# EasyEDA Pro project 电路图.eprj

# Schematic Schematic1
Board Name: Board1; Create Date: 2025-07-12; Page Name: P1; Project Name: 电路图; Schematic Name: Schematic1; Update Date: 2025-11-16; Company: 嘉立创EDA; Drawed: 陈师傅; Page Size: A4; Version: V1.0
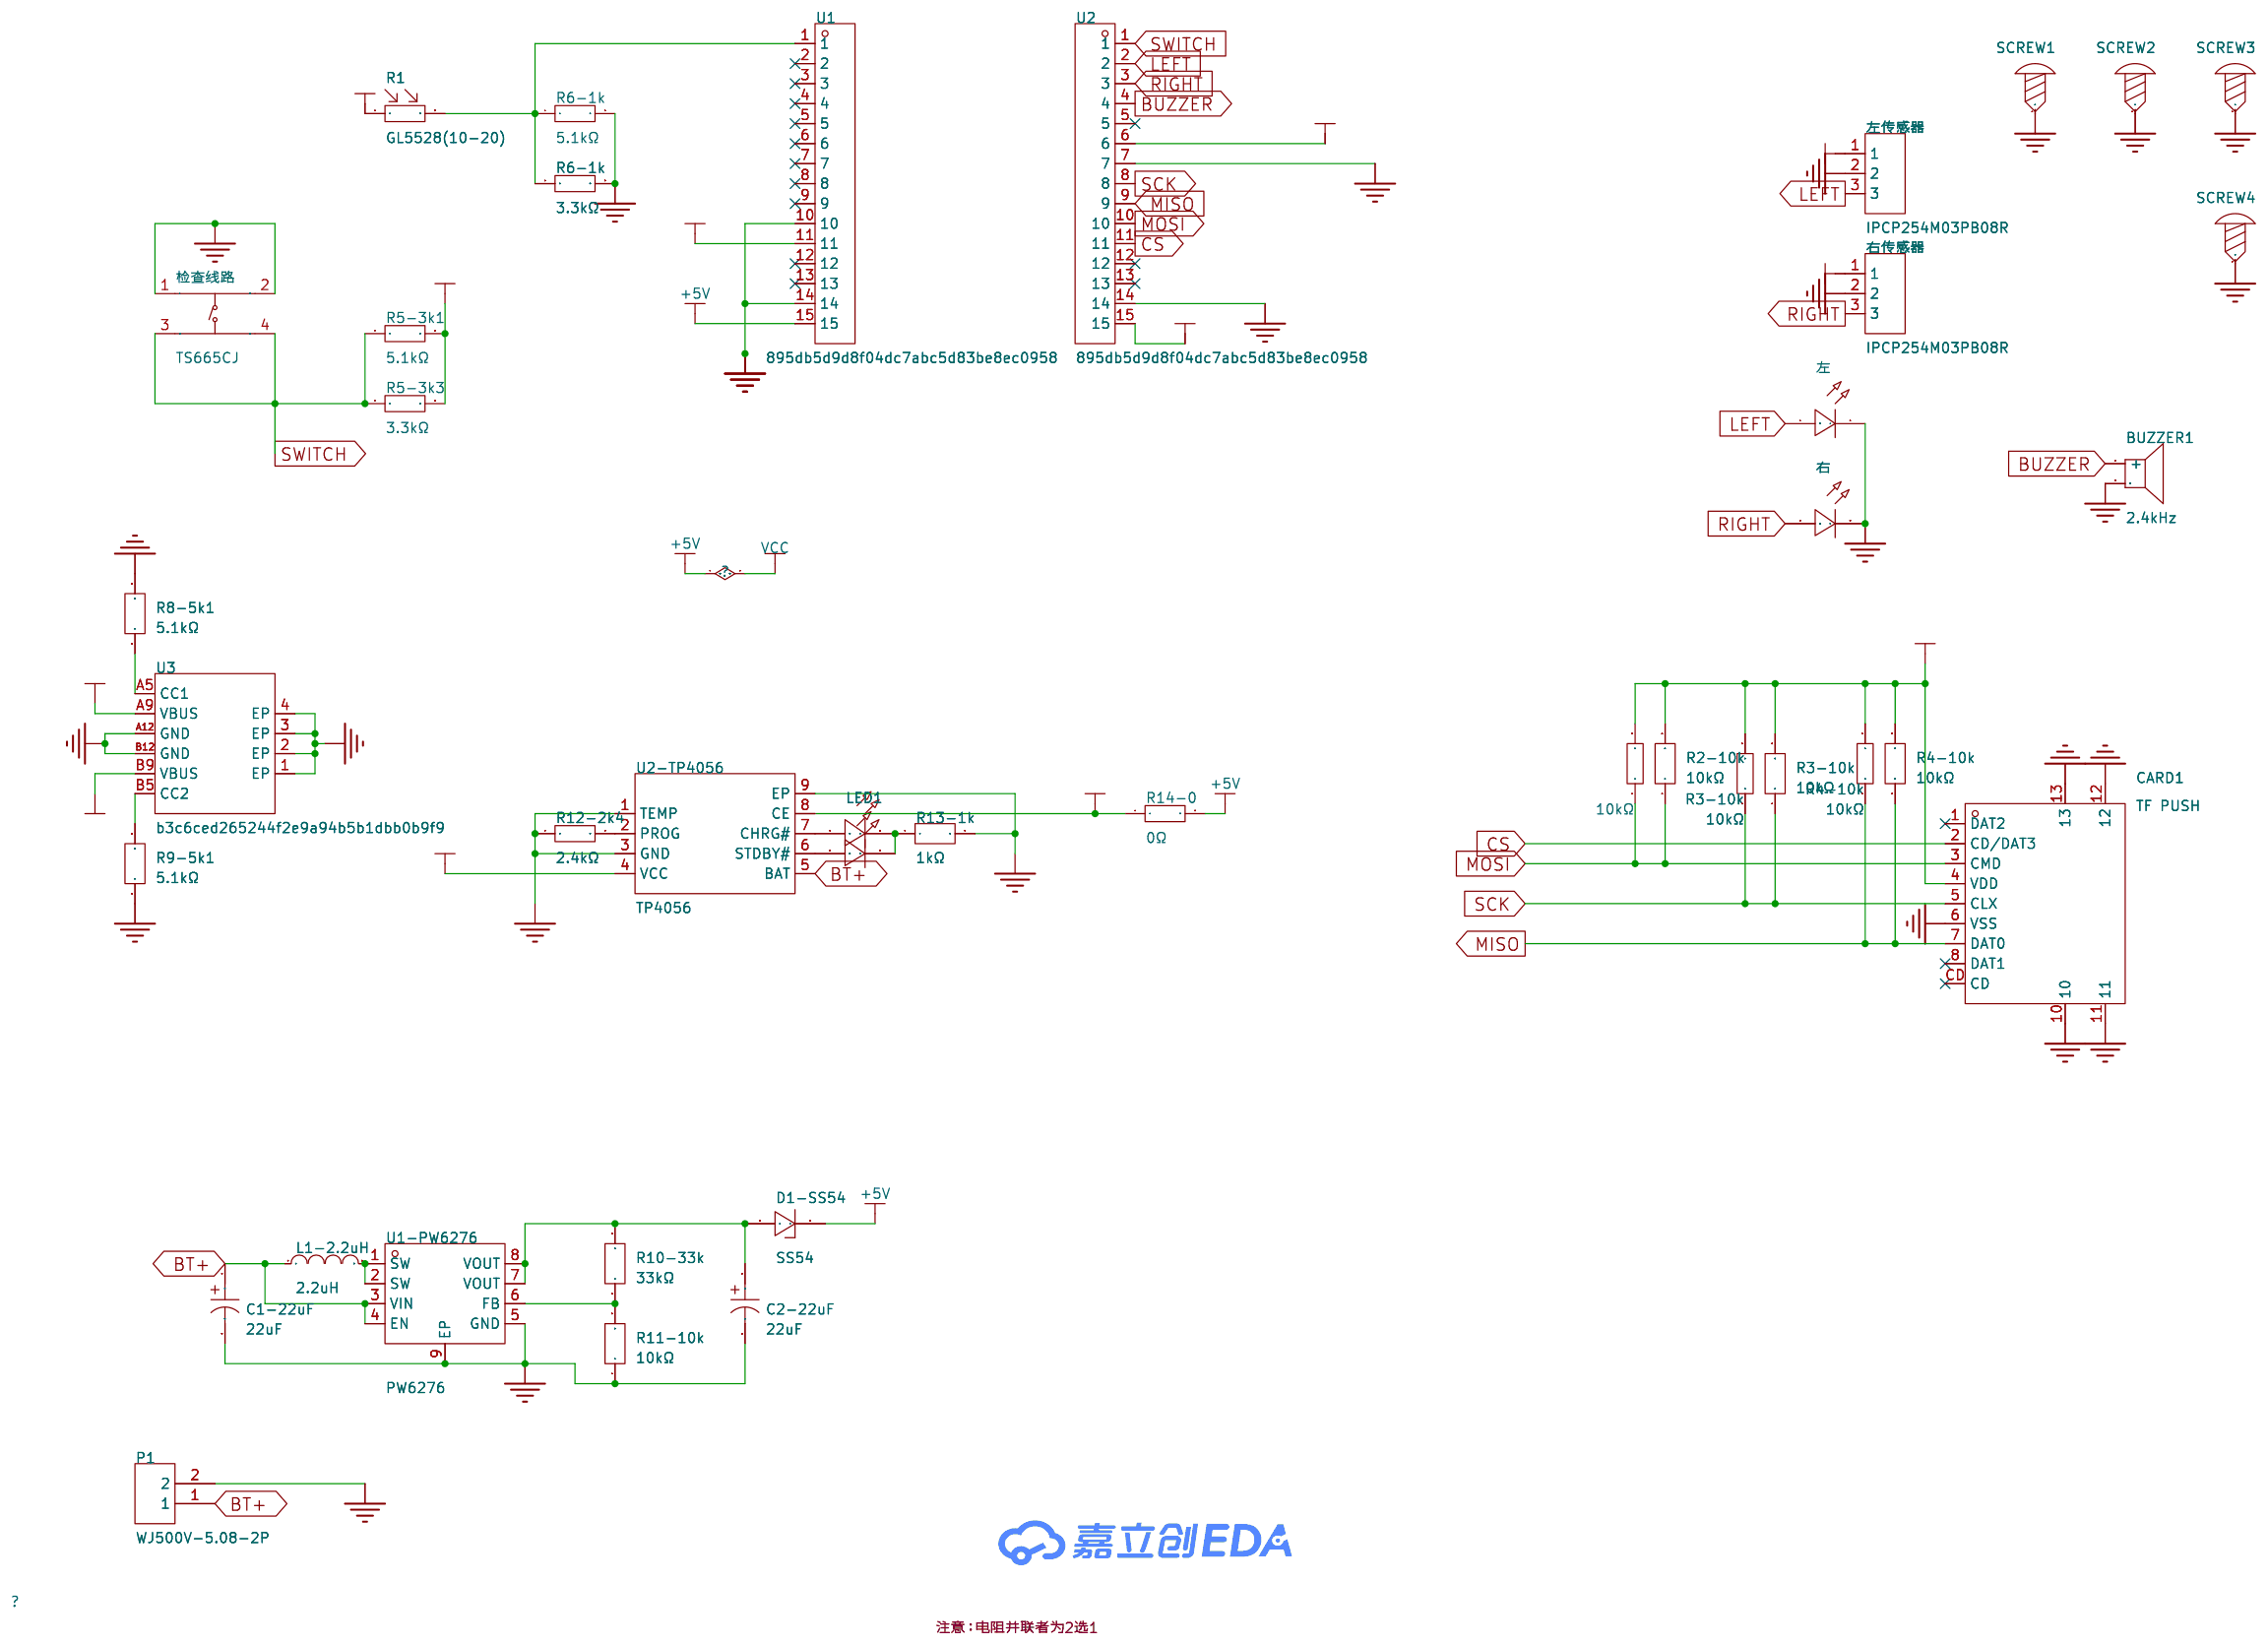
[diagram p0: schematic sheet]

## Parts
BUZZER1  2.4kHz  [BUZ-TH_BD12.0-P7.60-D0.6-FD]
C1-22uF  22uF  [CAP-TH_BD5.0-P2.00-D0.5-FD-1]
C2-22uF  22uF  [CAP-TH_BD5.0-P2.00-D0.5-FD-1]
CARD1  TF PUSH  [TF-SMD_TF-PUSH]
D1-SS54  SS54  [SMA_L4.3-W2.6-LS5.0-FD]
L1-2.2uH  2.2uH  [IND-SMD_L7.0-W6.6]
LED  -  [LED-TH_5mm]
LED1  -  [LED-TH_5mm]
P1  WJ500V-5.08-2P  [CONN-TH_2P-P5.00_WJ500V-5.08-2P]
R1  GL5528(10-20)  [RES-TH_L5.1-W4.3-P3.40-D0.5]
R2-10k  10kΩ  [R0603]
R2-10k#2  10kΩ  [RES-TH_BD2.3-L6.3-P10.30-D0.6]
R3-10k  10kΩ  [R0603]
R3-10k#2  10kΩ  [RES-TH_BD2.3-L6.3-P10.30-D0.6]
R4-10k  10kΩ  [R0603]
R4-10k#2  10kΩ  [RES-TH_BD2.3-L6.3-P10.30-D0.6]
R5-3k1  5.1kΩ  [R0603]
R5-3k3  3.3kΩ  [RES-TH_BD2.4-L6.3-P10.30-D0.6]
R6-1k  5.1kΩ  [R0603]
R6-1k#2  3.3kΩ  [RES-TH_BD2.4-L6.3-P10.30-D0.6]
R8-5k1  5.1kΩ  [RES-TH_BD2.3-L6.5-P10.50-D0.5]
R9-5k1  5.1kΩ  [RES-TH_BD2.3-L6.5-P10.50-D0.5]
R10-33k  33kΩ  [RES-TH_BD2.4-L6.3-P10.30-D0.6]
R11-10k  10kΩ  [RES-TH_BD2.4-L6.3-P10.30-D0.6]
R12-2k4  2.4kΩ  [RES-TH_BD2.4-L6.3-P10.30-D0.6]
R13-1k  1kΩ  [RES-TH_BD2.7-L6.2-P10.20-D0.4]
R14-0  0Ω  [RES-TH_BD2.5-L6.5-P10.50-D0.6]
SCREW1  -  [M3螺丝]
SCREW2  -  [M3螺丝]
SCREW3  -  [M3螺丝]
SCREW4  -  [M3螺丝]
U1  895db5d9d8f04dc7abc5d83be8ec0958  [HDR-TH_15P-P2.54-V-F-1]
U1-PW6276  PW6276  [ESOP-8_L4.9-W3.9-P1.27-LS6.0-BL-EP-1]
U2  895db5d9d8f04dc7abc5d83be8ec0958  [HDR-TH_15P-P2.54-V-F-1]
U2-TP4056  TP4056  [ESOP-8_L4.9-W3.9-P1.27-LS6.0-BL-EP]
U3  b3c6ced265244f2e9a94b5b1dbb0b9f9  [USB-C-SMD_HC-TYPE-C-6P-010B]
右  -  [LED-TH_5mm]
右传感器  IPCP254M03PB08R  [HDR-TH_3P-P2.54-H-M-W10.4]
左  -  [LED-TH_5mm]
左传感器  IPCP254M03PB08R  [HDR-TH_3P-P2.54-H-M-W10.4]
检查线路  TS665CJ  [SW-TH_4P-L6.0-W6.0-P4.50-LS6.5]

## Library data of the parts
BUZZER1 = TMB12A05_C96093: LCSC Part Name: TMB12A05; Supplier Part: C96093; Manufacturer: 华能; Manufacturer Part: TMB12A05; Supplier Footprint: 插件,D=12mm; JLCPCB Part Class: 扩展库; Datasheet: https://atta.szlcsc.com/upload/public/pdf/source/20241025/8A17FE04D767D19A35A06DEF9A82AB1E.pdf; Supplier: LCSC; Driver Circuitry: 有源(内含驱动线路); Technology: 电磁式; Voltage - Supply: 4V~8V; Sound Pressure Level(SPL): 85dB; Diameter(φD): 12mm; Height: 9.8mm
C1-22uF C2-22uF = SHC50V22UF03EC0750: LCSC Part Name: 停产 22uF ±20% 50V; Supplier Part: C5263893; Supplier Footprint: 插件,D5xL11mm; JLCPCB Part Class: 扩展库; Supplier: LCSC; Tolerance: ±20%; Voltage Rating: 50V; Pin Spacing: 2mm; Diameter: 5mm; Height - Seated (Max): 11mm
CARD1 = TF PUSH: 卡连接方式:自弹式;卡类型:MicroSD卡(TF卡);连接器类型:卡座;本体最大高度:2mm;工作温度范围:-20℃~+90℃;; LCSC Part Name: 自弹式 MicroSD卡(TF卡) 卡座; Supplier Part: C393941; Manufacturer: SHOU HAN(首韩); Supplier Footprint: SMD; JLCPCB Part Class: 扩展库; Datasheet: https://atta.szlcsc.com/upload/public/pdf/source/20191011/C393941_0DDD896EE907FEB750D8B7B8982E2A67.pdf; Supplier: LCSC; Card Connection Mode: 自弹式; Card Type: MicroSD卡(TF卡); Connector Type: 卡座; Additional Card Detection Pins: 无; Maximum Body Height: 2mm; Operating Temperature Range: -20℃~+90℃
D1-SS54 = SS54_C7420369: LCSC Part Name: 电压:40V 电流:5A; Supplier Part: C7420369; Manufacturer: R+O(宏嘉诚); Supplier Footprint: SMA(DO-214AC); JLCPCB Part Class: 扩展库; Datasheet: https://item.szlcsc.com/datasheet/SS54/8397191.html; Supplier: LCSC; Diode Configuration: 独立式; Voltage - Forward(Vf@If): 550mV@5.0A; Voltage - DC Reverse(Vr): 40V; Current - Rectified: 5A; Reverse Leakage Current (Ir): 50uA@40V; Operating Junction Temperature Range: -55℃~+125℃; Non-Repetitive Peak Forward Surge Current: 120A
L1-2.2uH = FXL0630-2R2-M: LCSC Part Name: 2.2uH ±20% 10A; Supplier Part: C167218; Manufacturer: cjiang(长江微电); Supplier Footprint: SMD,7x6.6mm; JLCPCB Part Class: 扩展库; Datasheet: https://item.szlcsc.com/datasheet/FXL0630-2R2-M/178601.html; Supplier: LCSC; Tolerance: ±20%; Current Rating: 9.5A; Current - Saturation(Isat): 10A; DC Resistance(DCR): 15mΩ; Type: 一体成型电感
LED = LED_TH-G_5mm: Supplier Footprint: 插件
LED1 右 左 = LED_TH-R_5mm: Supplier Footprint: 插件
P1 = WJ500V-5.08-2P: LCSC Part Name: 1x2P 5.08mm 直插 排数:1 每排P数:2; Supplier Part: C8465; Manufacturer: KANGNEX(康奈克斯电气); Supplier Footprint: 插件,P=5.08mm; JLCPCB Part Class: 扩展库; Datasheet: https://atta.szlcsc.com/upload/public/pdf/source/20191225/C8465_02D34CE5B5B4A53DF5891601D97FA9F4.pdf; Supplier: LCSC; Structure: 1x2P; Pitch: 5.08mm; Color: 绿色; Mounting Style: 直插; Current Rating (Max): 18A; Voltage Rating (Max): 250V; Number of Pins: 2P; Number of Rows: 1; Wire Gauge - AWG: 14~30; Wire Gauge - mm2: 2.5; Number of PINs Per Row: 2; Operating Temperature Range: -40℃~+105℃; Screw Specification: M2.5
R1 = GL5528(10-20)_C10081: Supplier Part: C10081; Manufacturer: JCHL(晶创和立); Supplier Footprint: 插件,P=3.4mm; JLCPCB Part Class: 扩展库; Datasheet: https://atta.szlcsc.com/upload/public/pdf/source/20200417/C515010_C10502EF7F431E893A7F20DB83F527F0.pdf; Supplier: LCSC; Dark Resistance: 1MΩ; Cell Resistance @ Illuminance: 10kΩ~20kΩ; Voltage - Max: 150V; Wavelength - Peak: 540nm
R2-10k R3-10k R4-10k = 0603WAF1002T5E: 电阻类型:厚膜电阻;阻值:10kΩ;精度:±1%;功率:100mW;工作电压:75V;温度系数:±100ppm/℃;; LCSC Part Name: 厚膜电阻 10kΩ ±1% 100mW; Supplier Part: C25804; Manufacturer: UNI-ROYAL(厚声); Supplier Footprint: 0603; JLCPCB Part Class: Basic Part; Datasheet: https://atta.szlcsc.com/upload/public/pdf/source/20200306/C422600_1E6D84923E4A46A82E41ADD87F860B5C.pdf; Supplier: LCSC; Type: 厚膜电阻; Tolerance: ±1%; Power(Watts): 100mW; Voltage-Supply(Max): 75V; Temperature Coefficient: ±100ppm/℃; Operating Temperature: -55℃~+155℃
R2-10k#2 R3-10k#2 R4-10k#2 = LR1F10K: LCSC Part Name: 金属膜电阻 10kΩ ±1% 600mW; Supplier Part: C1367502; Manufacturer: TE Connectivity(泰科电子); Supplier Footprint: 插件; JLCPCB Part Class: 扩展库; Datasheet: https://item.szlcsc.com/datasheet/LR1F10K/1457791.html; Supplier: LCSC; Type: 金属膜电阻; Tolerance: ±1%; Power(Watts): 600mW; Temperature Coefficient: ±50ppm/℃; Operating Temperature: -55℃~+155℃
R5-3k1 R6-1k = 0603WAF5101T5E: LCSC Part Name: 5.1kΩ ±1% 100mW 厚膜电阻; Supplier Part: C23186; Manufacturer: UNI-ROYAL(厚声); Supplier Footprint: 0603; JLCPCB Part Class: 基础库; Datasheet: https://item.szlcsc.com/datasheet/0603WAF5101T5E/23913.html; Supplier: LCSC; Type: 厚膜电阻; Tolerance: ±1%; Power(Watts): 100mW; Voltage-Supply(Max): 75V; Temperature Coefficient: ±100ppm/℃; Operating Temperature: -55℃~+155℃
R5-3k3 R6-1k#2 = MFR50SFTE52-3K3: LCSC Part Name: 金属膜电阻 3.3kΩ ±1% 500mW 铜脚，圆柱状直插; Supplier Part: C173154; Manufacturer: YAGEO(国巨); Supplier Footprint: 插件,D2.4xL6.3mm; JLCPCB Part Class: 扩展库; Datasheet: https://atta.szlcsc.com/upload/public/pdf/source/20240715/954B77424FA37AD87C8D0E9E8395A6B5.pdf; Supplier: LCSC; Type: 金属膜电阻; Tolerance: ±1%; Power(Watts): 500mW; Temperature Coefficient: ±50ppm/℃; Operating Temperature: -55℃~+155℃
R8-5k1 R9-5k1 = MF1/4W-5.1KΩ±1%T52: LCSC Part Name: 金属膜电阻 5.1kΩ ±1% 250mW; Supplier Part: C714010; Manufacturer: 华星机电; Supplier Footprint: 插件,D2.3xL6.5mm; JLCPCB Part Class: 扩展库; Datasheet: https://atta.szlcsc.com/upload/public/pdf/source/20200731/C713882_AE8EB1102749D7E4FB4FB13DC898C429.pdf; Supplier: LCSC; Type: 金属膜电阻; Tolerance: ±1%; Power(Watts): 250mW; Temperature Coefficient: ±200ppm/℃
R10-33k = MFP-25BRD52-33K: LCSC Part Name: 金属膜电阻 33kΩ ±0.1% 250mW; Supplier Part: C1741268; Manufacturer: YAGEO(国巨); Supplier Footprint: 插件,D2.4xL6.3mm; JLCPCB Part Class: 扩展库; Datasheet: https://atta.szlcsc.com/upload/public/pdf/source/20241025/DD7B7527142F6D2A29C64E78F171A881.pdf; Supplier: LCSC; Type: 金属膜电阻; Tolerance: ±0.1%; Power(Watts): 250mW; Temperature Coefficient: ±25ppm/℃; Operating Temperature: -55℃~+155℃
R11-10k = RN1/4W10KFT/BA1: LCSC Part Name: 10kΩ ±1% 250mW 金属膜电阻; Supplier Part: C410695; Manufacturer: Tyohm(幸亚电阻); Supplier Footprint: 插件,D2.4xL6.5mm; JLCPCB Part Class: 扩展库; Datasheet: https://atta.szlcsc.com/upload/public/pdf/source/20250211/2C0505E212032D72CE625B2E6B5197BA.pdf; Supplier: LCSC; Type: 金属膜电阻; Tolerance: ±1%; Voltage-Supply(Max): 250V; Power(Watts): 250mW; Temperature Coefficient: ±50ppm/℃; Operating Temperature: -55℃~+125℃
R12-2k4 = MFR-25FTE52-2K4: LCSC Part Name: 金属膜电阻 2.4kΩ ±1% 250mW 铜脚，圆柱状直插; Supplier Part: C172998; Manufacturer: YAGEO(国巨); Supplier Footprint: 插件,D2.4xL6.3mm; JLCPCB Part Class: 扩展库; Datasheet: https://atta.szlcsc.com/upload/public/pdf/source/20191118/C457825_18355E864DE4965678DC27B0EBC3E21E.pdf; Supplier: LCSC; Type: 金属膜电阻; Tolerance: ±1%; Power(Watts): 250mW; Temperature Coefficient: ±50ppm/℃; Operating Temperature: -55℃~+155℃
R13-1k = MF1/4W-1K±1%-ST52: LCSC Part Name: 金属膜电阻 1kΩ ±1% 250mW; Supplier Part: C2903245; Manufacturer: VO(翔胜); Supplier Footprint: 插件,D2.7xL6.2mm; JLCPCB Part Class: 扩展库; Datasheet: https://atta.szlcsc.com/upload/public/pdf/source/20241217/72FEFC4F99972FE0FB9B38B807463E29.pdf; Supplier: LCSC; Type: 金属膜电阻; Tolerance: ±1%; Voltage-Supply(Max): 250V; Power(Watts): 250mW; Temperature Coefficient: ±100ppm/℃; Operating Temperature: -55℃~+155℃
R14-0 = RN1/4W0RT/BA1: LCSC Part Name: 金属膜电阻 0Ω ±1% 250mW; Supplier Part: C410698; Manufacturer: Tyohm(幸亚电阻); Supplier Footprint: 插件,D2.4xL6.4mm; JLCPCB Part Class: 扩展库; Datasheet: https://item.szlcsc.com/datasheet/RN1%252F4W0RT%252FBA1/401619.html; Supplier: LCSC; Type: 金属膜电阻; Tolerance: ±1%; Power(Watts): 250mW
SCREW1-SCREW4 = M3螺丝: Supplier Footprint: 插件
U1 U2 = BX-PM2.54-1-15PY: 插孔结构:1x15P;间距:2.54mm;行距:-;圆孔/方孔:方孔;安装方式:直插;排数:单排;总孔位数:15P;额定电流:3A;额定电压:-;插孔方向:顶部;塑高:8.5mm;触头材质:-;触头镀层:金;工作温度:-40℃~+105℃;; LCSC Part Name: 1x15P 间距:2.54mm 直插; Supplier Part: C18078136; Manufacturer: Bossie(博锡); Supplier Footprint: 插件,P=2.54mm; JLCPCB Part Class: 扩展库; Datasheet: https://atta.szlcsc.com/upload/public/pdf/source/20231017/E7C87C5FAA326EA1BCED90F41F0BE953.pdf; Supplier: LCSC; Holes Structure: 1x15P; Pitch: 2.54mm; Circular Hole / Square Hole: 方孔; Mounting Type: 直插; Number of Rows: 单排; Number of Positions: 15P; Current Rating: 3A; Holes Direction: 顶部; Insulation Height: 8.5mm; Contact Plating: 金; Operating Temperature: -40℃~+105℃; PIN Length: 3.2mm
U1-PW6276 = PW6276: Supplier Part: C9900042649; Supplier Footprint: SOP8-EP; Supplier: LCSC
U2-TP4056 = TP4056_C725790: LCSC Part Name: 1A独立式线性锂离子电池充电器; Supplier Part: C725790; Manufacturer: UMW(友台半导体); Supplier Footprint: ESOP-8; JLCPCB Part Class: 扩展库; Datasheet: https://item.szlcsc.com/datasheet/TP4056/772193.html; Supplier: LCSC; The Chip Type: 线性充电芯片; Voltage - Supply: 3.7V~6.5V; Charge Current - Max: 1A; Charging Saturation Voltage: 4.2V; Type of Battery: 锂离子; Number of Cells: 1; Operating Temperature: -40℃~+85℃; Battery Temperature Detection: 支持; 0V Battery Charge: 支持; Supply Current (Iq): 35uA
U3 = HC-TYPE-C-6P-010C: 连接器类型:Type-C;协议标准:-;公母:母;安装方式:卧贴;触点数量:6P;端口数量:1;额定电流 - 电源:3A;工作温度:-25℃~+85℃;; LCSC Part Name: 黑色 Type-C 母 卧贴 TYPE-C-6P 板上型无弹 L6.8mm 304不锈钢 LCP; Supplier Part: C19274014; Manufacturer: HC(虹成电子); Supplier Footprint: SMD; JLCPCB Part Class: 扩展库; Datasheet: https://atta.szlcsc.com/upload/public/pdf/source/20250217/CDACBD6800B28C1A11746C396D8A6A67.pdf; Supplier: LCSC; Connector Type: Type-C; Gender: 母; Mounting Type: 卧贴; Number of Contacts: 6P; Number of Ports: 1; Current Rating-Power: 3A; Voltage Rating: 5V; Connect-Disconnect Life: 5千次; Center Height: 1.58mm; Length: 6.8mm; Detection color: 黑色; Operating Temperature: -25℃~+85℃
右传感器 左传感器 = IPCP254M03PB08R: 插针结构:1x3P;间距:2.54mm;圆针/方针:方针;安装方式:弯插;排数:单排;总PIN位数:3P;额定电流:3A;额定电压:-;塑高:2.5mm;触头材质:黄铜;触头镀层:金;工作温度:-40℃~+105℃;颜色:黑色;; LCSC Part Name: 1x3P 间距:2.54mm 方针 弯插; Supplier Part: C22395593; Manufacturer: INCP; Supplier Footprint: 弯插,P=2.54mm; JLCPCB Part Class: 扩展库; Datasheet: https://atta.szlcsc.com/upload/public/pdf/source/20250208/975C7ED3E6965D9726D213BB1A1DEC82.pdf; Supplier: LCSC; Pin Structure: 1x3P; Pitch: 2.54mm; Circluar Pins/Square Pins: 方针; Mounting Type: 弯插; Number of Rows: 单排; Number of Pins: 3P; Current Rating: 3A; Insulation Height: 2.5mm; Contact Material: 黄铜; Contact Plating: 金; Operating Temperature: -40℃~+105℃; Color: 黑色
检查线路 = TS665CJ: LCSC Part Name: 6*6*5mm 直插 轻触开关; Supplier Part: C393938; Manufacturer: SHOU HAN(首韩); Supplier Footprint: 插件; JLCPCB Part Class: 扩展库; Datasheet: https://atta.szlcsc.com/upload/public/pdf/source/20190521/C393938_BDABEAC600B4C55E200A80AA129B70BC.pdf; Supplier: LCSC; Circuit: 单刀单掷; Actuator Style: 圆形按钮; Mounting Style: 直插; Switch Length: 6mm; Switch Width: 6mm; Switch Height: 5mm; Contact Current: 50mA; Voltage Rating (DC): 12V

## Nets
3V3: CARD1.4(VDD) R1.1 R2-10k.2 R2-10k#2.2 R3-10k.2 R3-10k#2.2 R4-10k.2 R4-10k#2.2 R5-3k1.2 R5-3k3.2 U1.11 U2.6 U2.15 右传感器.1 左传感器.1
+5V: D1-SS54.2(K) R14-0.2 U1.15
GND: BUZZER1.2 C1-22uF.2 C2-22uF.2 CARD1.6(VSS) CARD1.10 CARD1.11 CARD1.12 CARD1.13 P1.2 R6-1k.2 R6-1k#2.2 R8-5k1.2 R9-5k1.1 R11-10k.1 R12-2k4.1 R13-1k.2 SCREW1.1 SCREW2.1 SCREW3.1 SCREW4.1 U1.10 U1.14 U1-PW6276.5(GND) U1-PW6276.9(EP) U2.7 U2.14 U2-TP4056.1(TEMP) U2-TP4056.3(GND) U2-TP4056.9(EP) U3.1(EP) U3.2(EP) U3.3(EP) U3.4(EP) U3.A12(GND) U3.B12(GND) 右.2(A) 右传感器.2 左.2(A) 左传感器.2 检查线路.1(A) 检查线路.2(B)
BT+: C1-22uF.1 L1-2.2uH.1 P1.1 U1-PW6276.3(VIN) U1-PW6276.4(EN) U2-TP4056.5(BAT)
BUZZER: BUZZER1.1(+) U2.4
CS: CARD1.2(CD/DAT3) U2.11
LEFT: U2.2 左.1(C) 左传感器.3
MISO: CARD1.7(DAT0) R4-10k.1 R4-10k#2.1 U2.9
MOSI: CARD1.3(CMD) R2-10k.1 R2-10k#2.1 U2.10
RIGHT: U2.3 右.1(C) 右传感器.3
SCK: CARD1.5(CLX) R3-10k.1 R3-10k#2.1 U2.8
SWITCH: R5-3k1.1 R5-3k3.1 U2.1 检查线路.3(C) 检查线路.4(D)
USBIN: R14-0.1 U2-TP4056.4(VCC) U2-TP4056.8(CE) U3.A9(VBUS) U3.B9(VBUS)
$1N4715: L1-2.2uH.2 U1-PW6276.1(SW) U1-PW6276.2(SW)
$1N4719: C2-22uF.1 D1-SS54.1(A) R10-33k.2 U1-PW6276.7(VOUT) U1-PW6276.8(VOUT)
$1N5109: R10-33k.1 R11-10k.2 U1-PW6276.6(FB)
$1N5991: R9-5k1.2 U3.B5(CC2)
$1N5992: R8-5k1.1 U3.A5(CC1)
$1N6384: R12-2k4.2 U2-TP4056.2(PROG)
$1N6472: LED1.1(C) U2-TP4056.6(STDBY#)
$1N6520: LED.1(C) U2-TP4056.7(CHRG#)
$1N6547: LED.2(A) LED1.2(A) R13-1k.1
Net-(R1-2): R1.2 R6-1k.1 R6-1k#2.1 U1.1

Not connected (* = marked no-connect by the designer): CARD1 1(DAT2)* 8(DAT1)* CD*; U1 2* 3* 4* 5* 6* 7* 8* 9* 12* 13*; U2 5* 12* 13*

# Board PCB1
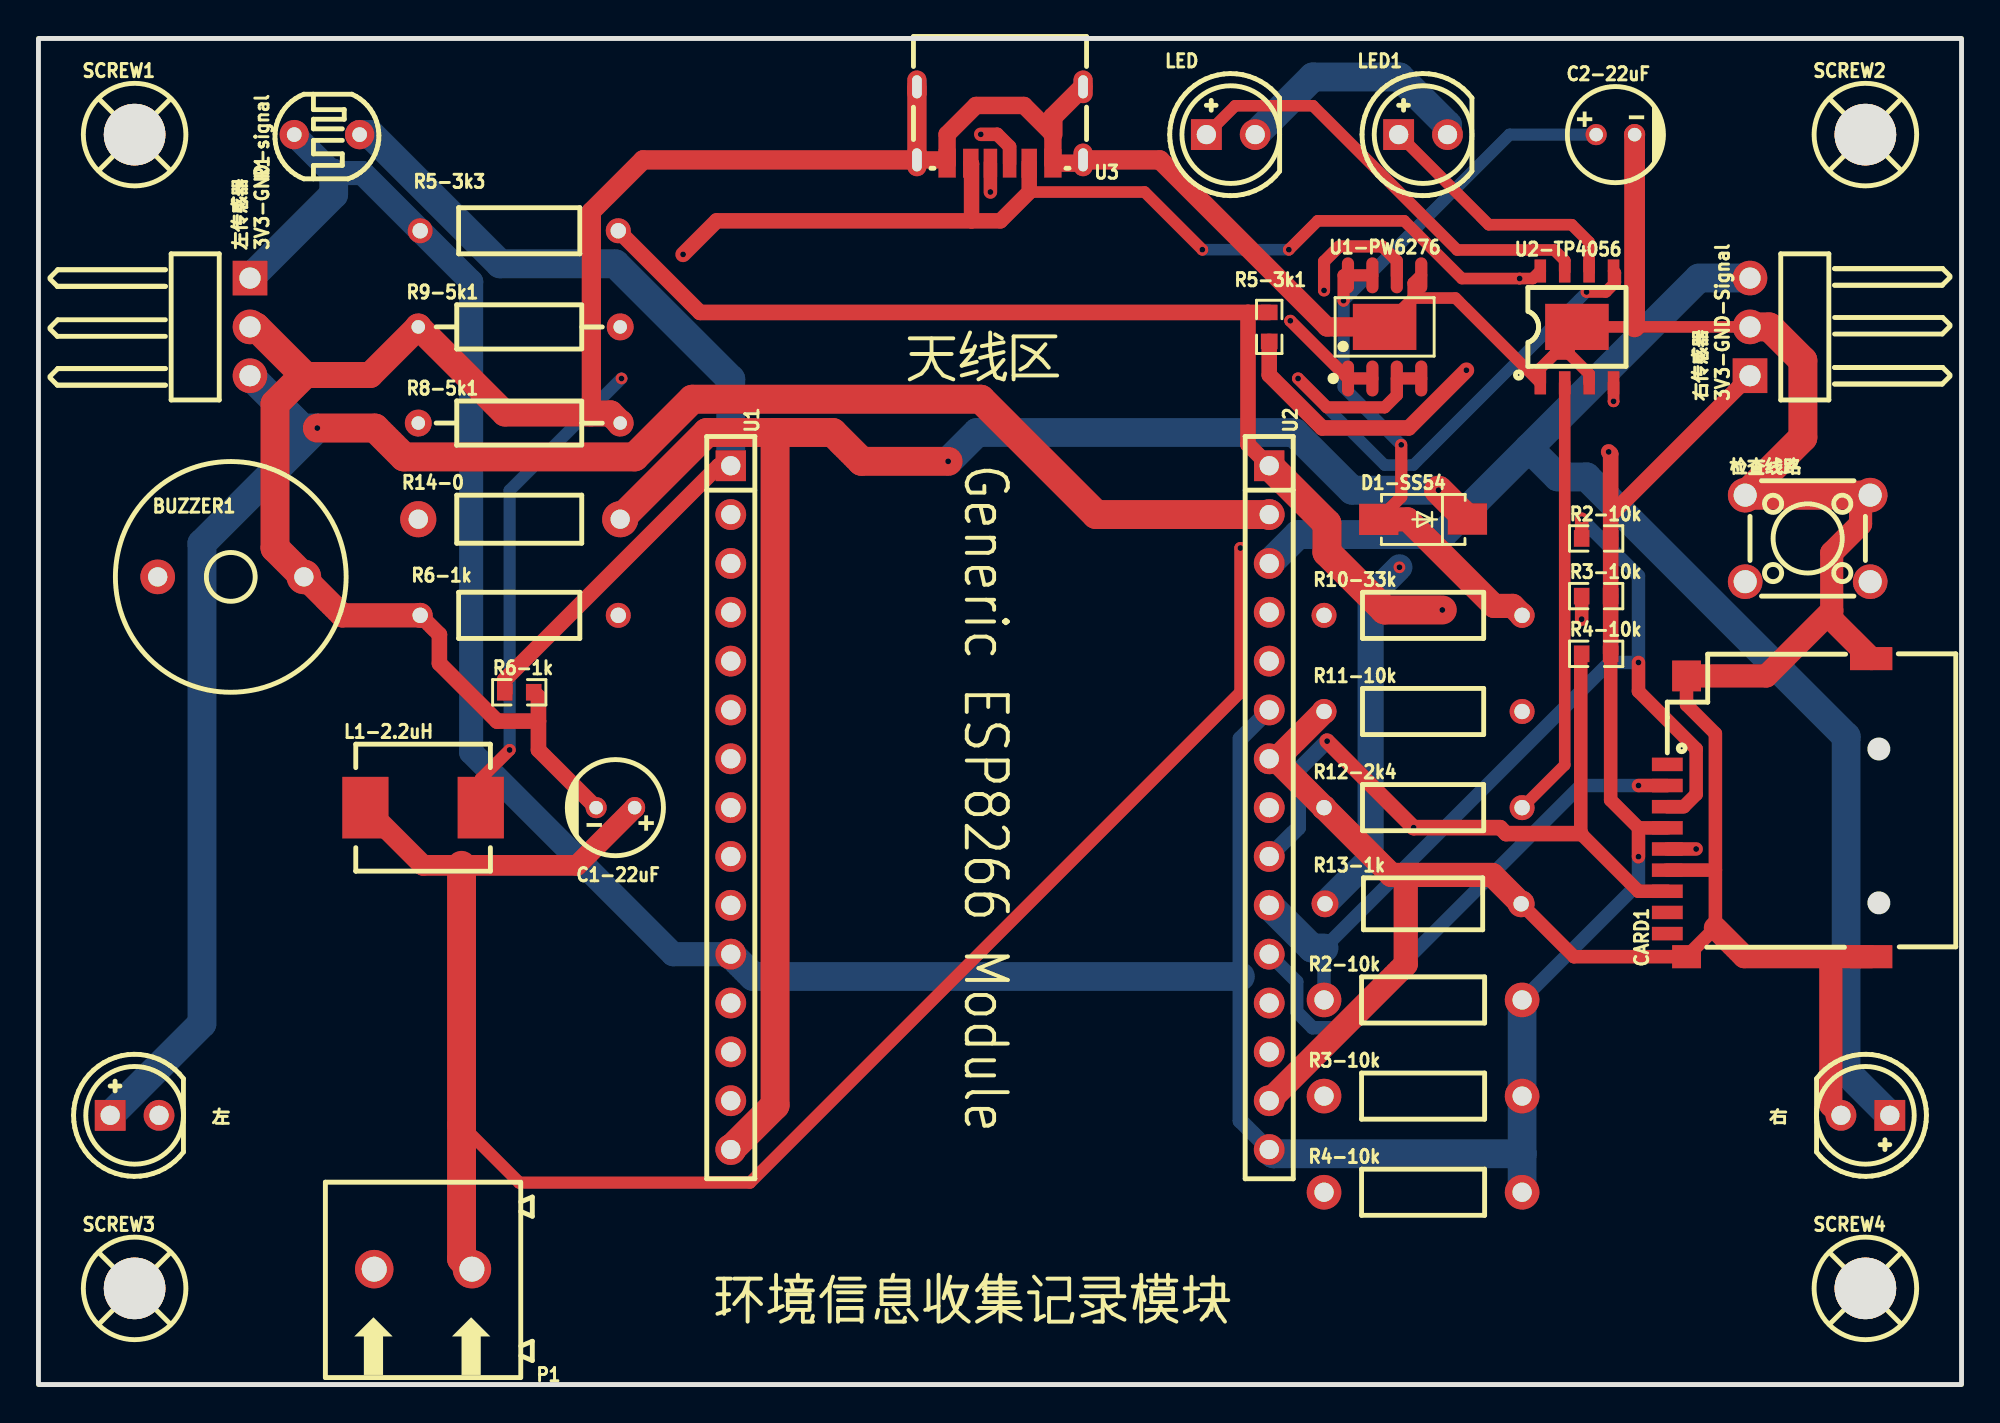
[diagram p1: board, top side]
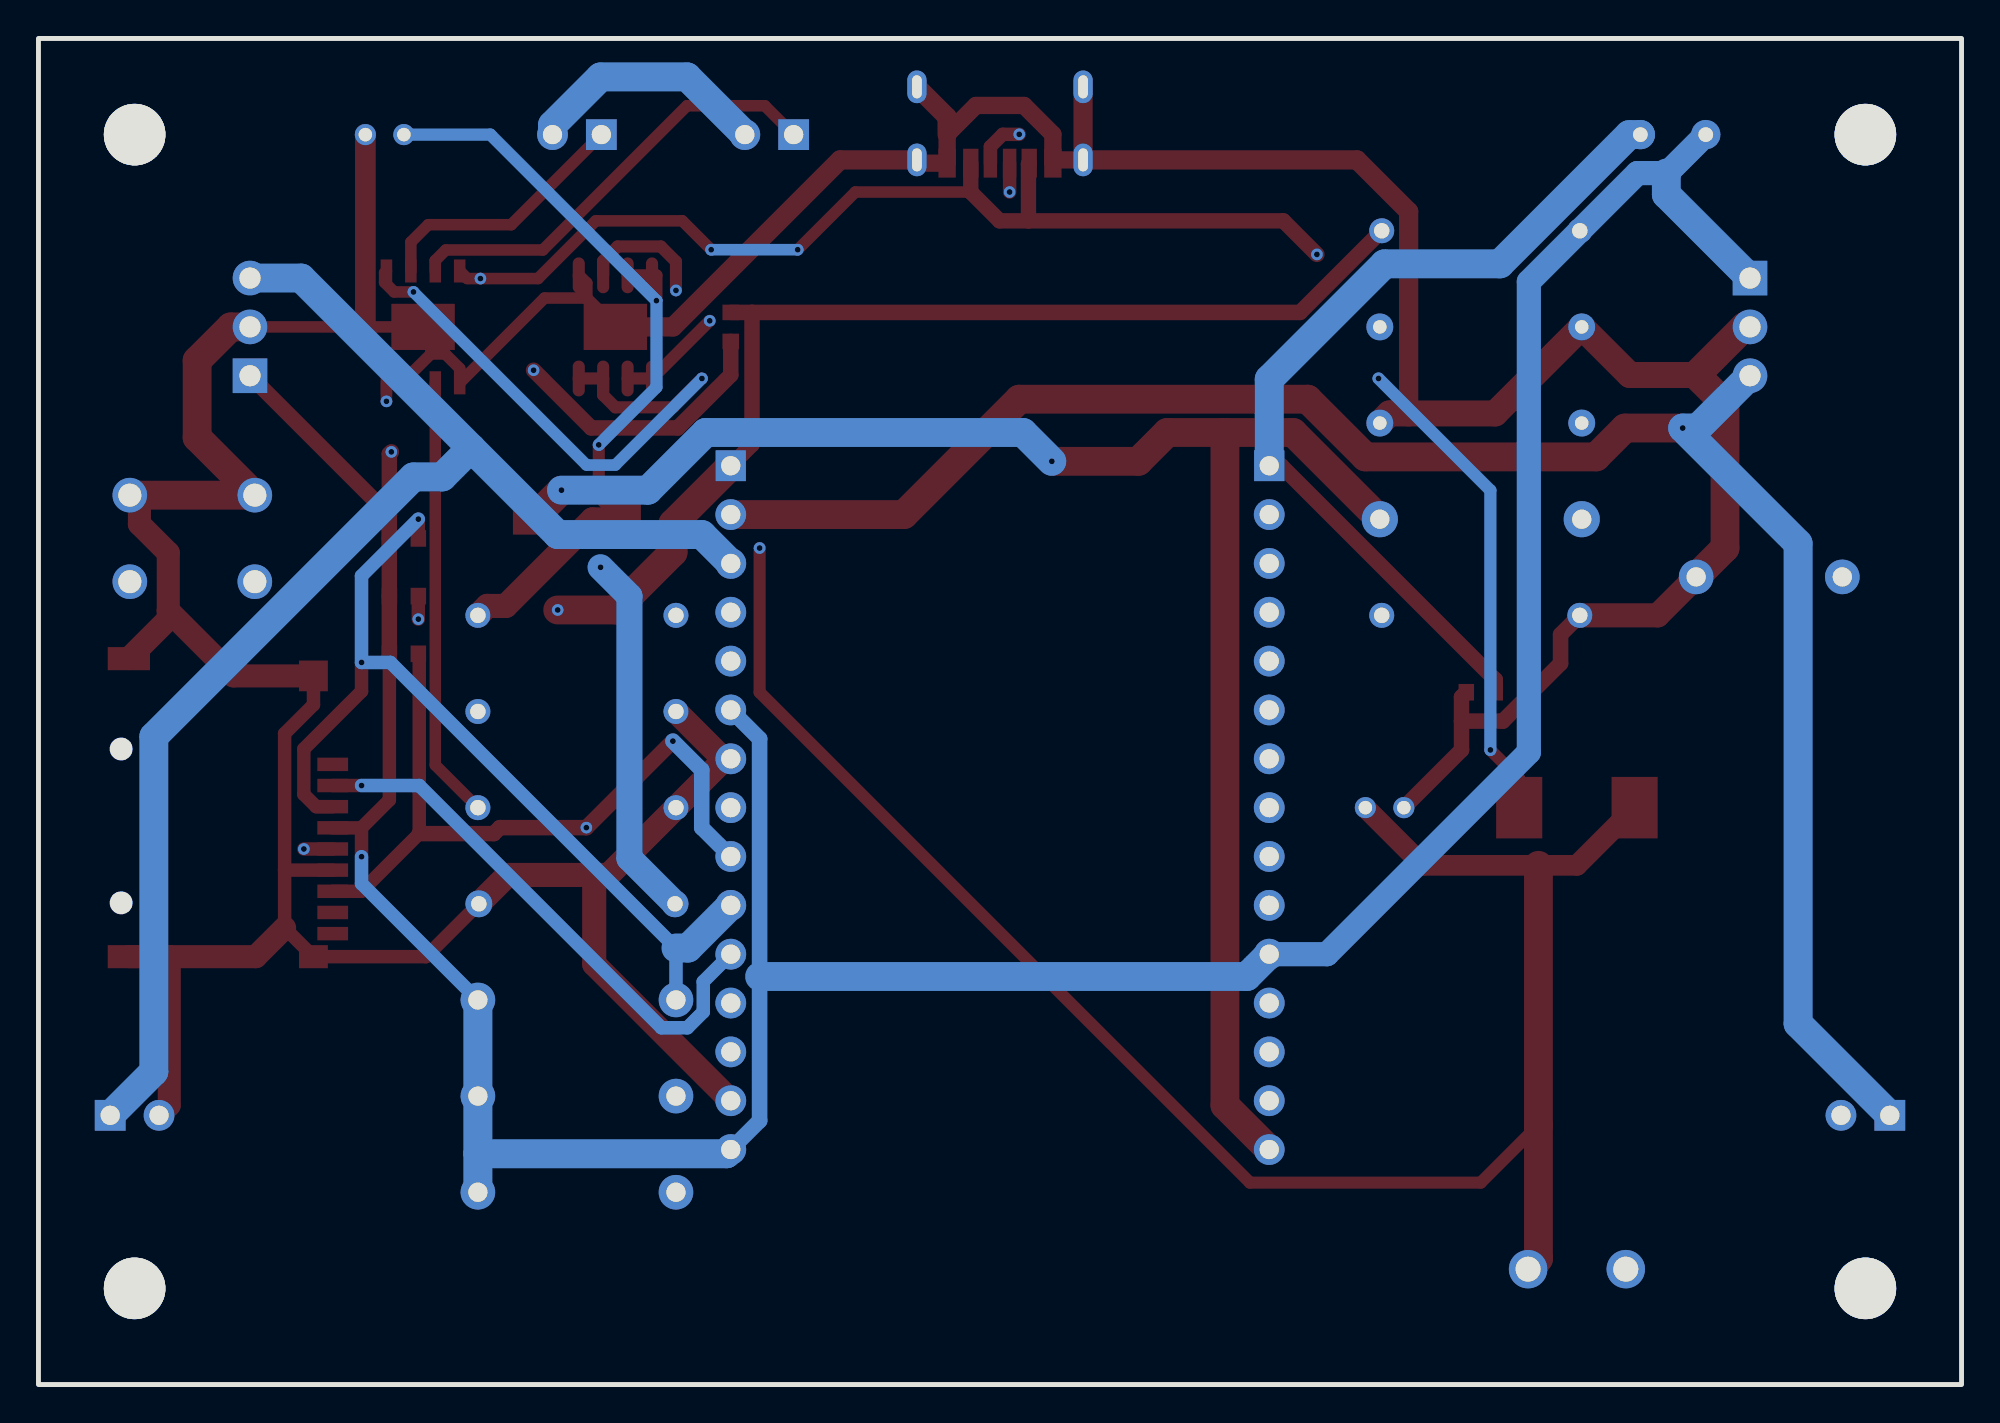
[diagram p2: board, bottom side, seen from below]

Outline 100 x 70 mm; copper layers: Top Layer, Inner1, Inner2, Bottom Layer. Coordinates in mm from the lower left corner of the outline.
Outline path: rectangle 0,70 100,0
Stack: Top Layer 0.035mm 外层铜厚1oz / Dielectric1 0.2104mm 7628 RC49% 8.6mil / Inner1 0.0152mm 内层铜厚 / Dielectric2 1.065mm 1.1mm H/HOZ Copper / Inner2 0.0152mm 内层铜厚 / Dielectric3 0.2104mm 7628 RC49% 8.6mil / Bottom Layer 0.035mm 外层铜厚1oz

## Design rules (mm)
template: 自定义配置
spacing copperThickness1oz (default): track to track 0.15, other pairs 0.152 to 0.3
spacing copperThickness2oz: track to track 0.203, other pairs 0.152 to 0.3
track width copperThickness1oz (default): min 0.5, default 1.5, max 3
track width copperThickness2oz: min 0.203, default 0.254, max 2.54
differential pair differentialPair (default): width min 0.127, default 0.254, max 2.54; gap min 0.152, default 0.152
via viaSize (default): diameter min 0.5, default 0.61, max 10; hole min 0.3, default 0.305, max 6.3

## Placement (name value [footprint] x y rotation side)
BUZZER1  2.4kHz  [BUZ-TH_BD12.0-P7.60-D0.6-FD]  10 42 0 top
C1-22uF  22uF  [CAP-TH_BD5.0-P2.00-D0.5-FD-1]  30 30 180 top
C2-22uF  22uF  [CAP-TH_BD5.0-P2.00-D0.5-FD-1]  82 65 0 top
CARD1  TF PUSH  [TF-SMD_TF-PUSH]  90 30 90 top
D1-SS54  SS54  [SMA_L4.3-W2.6-LS5.0-FD]  72 45 0 top
L1-2.2uH  2.2uH  [IND-SMD_L7.0-W6.6]  20 30 0 top
LED  -  [LED-TH_5mm]  62 65 0 top
LED1  -  [LED-TH_5mm]  72 65 0 top
P1  WJ500V-5.08-2P  [CONN-TH_2P-P5.00_WJ500V-5.08-2P]  20 6 180 top
R1  GL5528(10-20)  [RES-TH_L5.1-W4.3-P3.40-D0.5]  15 65 90 top
R2-10k  10kΩ  [R0603]  81 44 0 top
R2-10k#2  10kΩ  [RES-TH_BD2.3-L6.3-P10.30-D0.6]  72 20 0 top
R3-10k  10kΩ  [R0603]  81 41 0 top
R3-10k#2  10kΩ  [RES-TH_BD2.3-L6.3-P10.30-D0.6]  72 15 0 top
R4-10k  10kΩ  [R0603]  81 38 0 top
R4-10k#2  10kΩ  [RES-TH_BD2.3-L6.3-P10.30-D0.6]  72 10 0 top
R5-3k1  5.1kΩ  [R0603]  64 55 270 top
R5-3k3  3.3kΩ  [RES-TH_BD2.4-L6.3-P10.30-D0.6]  25 60 180 top
R6-1k  5.1kΩ  [RES-TH_BD2.4-L6.3-P10.30-D0.6]  25 40 180 top
R6-1k#2  3.3kΩ  [R0603]  25 36 0 top
R8-5k1  5.1kΩ  [RES-TH_BD2.3-L6.5-P10.50-D0.5]  25 50 0 top
R9-5k1  5.1kΩ  [RES-TH_BD2.3-L6.5-P10.50-D0.5]  25 55 0 top
R10-33k  33kΩ  [RES-TH_BD2.4-L6.3-P10.30-D0.6]  72 40 0 top
R11-10k  10kΩ  [RES-TH_BD2.4-L6.3-P10.30-D0.6]  72 35 0 top
R12-2k4  2.4kΩ  [RES-TH_BD2.4-L6.3-P10.30-D0.6]  72 30 0 top
R13-1k  1kΩ  [RES-TH_BD2.7-L6.2-P10.20-D0.4]  72 25 0 top
R14-0  0Ω  [RES-TH_BD2.5-L6.5-P10.50-D0.6]  25 45 0 top
SCREW1  -  [M3螺丝]  5 65 0 top
SCREW2  -  [M3螺丝]  95 65 0 top
SCREW3  -  [M3螺丝]  5 5 0 top
SCREW4  -  [M3螺丝]  95 5 0 top
U1  895db5d9d8f04dc7abc5d83be8ec0958  [HDR-TH_15P-P2.54-V-F-1]  36 30 270 top
U1-PW6276  PW6276  [ESOP-8_L4.9-W3.9-P1.27-LS6.0-BL-EP-1]  70 55 0 top
U2  895db5d9d8f04dc7abc5d83be8ec0958  [HDR-TH_15P-P2.54-V-F-1]  64 30 270 top
U2-TP4056  TP4056  [ESOP-8_L4.9-W3.9-P1.27-LS6.0-BL-EP]  80 55 0 top
U3  b3c6ced265244f2e9a94b5b1dbb0b9f9  [USB-C-SMD_HC-TYPE-C-6P-010B]  50 65.5 180 top
右  -  [LED-TH_5mm]  95 14 180 top
右传感器
3V3-GND-Signal  -  [HDR-TH_3P-P2.54-H-M-W10.4]  89 55 90 top
左  -  [LED-TH_5mm]  5 14 0 top
左传感器
3V3-GND-signal  -  [HDR-TH_3P-P2.54-H-M-W10.4]  11 55 270 top
检查线路  TS665CJ  [SW-TH_4P-L6.0-W6.0-P4.50-LS6.5]  92 44 0 top

## Footprints (pads in the part's own frame, mm; a bottom-side part is the same pattern mirrored in y, then rotated)
BUZ-TH_BD12.0-P7.60-D0.6-FD
  round 1.8 hole 1: 1(-3.8,0) 2(3.8,0)
CAP-TH_BD5.0-P2.00-D0.5-FD-1
  round 1.1 hole 0.7: 1(-1,0) 2(1,0)
CONN-TH_2P-P5.00_WJ500V-5.08-2P
  round 2 hole 1.3: 1(-2.54,0) 2(2.54,0)
ESOP-8_L4.9-W3.9-P1.27-LS6.0-BL-EP
  rect 0.6x1.2 smd: 1(-1.905,-2.909) 2(-0.635,-2.909) 3(0.635,-2.909) 4(1.905,-2.909) 5(1.905,2.909) 6(0.635,2.909) 7(-0.635,2.909) 8(-1.905,2.909)
  rect 3.3x2.4 smd: 9(0,0)
ESOP-8_L4.9-W3.9-P1.27-LS6.0-BL-EP-1
  oval 0.63x1.865 smd: 1(-1.905,-2.683) 2(-0.635,-2.683) 3(0.635,-2.683) 4(1.905,-2.683) 5(1.905,2.683) 6(0.635,2.683) 7(-0.635,2.683) 8(-1.905,2.683)
  rect 3.3x2.4 smd: 9(0,0)
HDR-TH_3P-P2.54-H-M-W10.4
  rect 1.8x1.8 hole 1.1: 1(-2.54,0)
  round 1.8 hole 1.1: 2(0,0) 3(2.54,0)
HDR-TH_15P-P2.54-V-F-1
  rect 1.6x1.575 hole 1: 1(-17.78,0)
  round 1.6 hole 1: 2(-15.24,0) 3(-12.7,0) 4(-10.16,0) 5(-7.62,0) 6(-5.08,0) 7(-2.54,0) 8(0,0) 9(2.54,0) 10(5.08,0) 11(7.62,0) 12(10.16,0) 13(12.7,0) 14(15.24,0) 15(17.78,0)
IND-SMD_L7.0-W6.6
  rect 2.4x3.2 smd: 1(-3,0) 2(3,0)
LED-TH_5mm
  rect 1.6x1.6 hole 1: 1(-1.27,0)
  round 1.6 hole 1: 2(1.27,0)
M3螺丝
  round 3.2 hole 3.2: 1(0,0)
R0603
  rect 0.806x0.864 smd: 1(-0.753,0) 2(0.753,0)
RES-TH_BD2.3-L6.3-P10.30-D0.6
  round 1.8 hole 1: 1(-5.15,0) 2(5.15,0)
RES-TH_BD2.3-L6.5-P10.50-D0.5
  round 1.4 hole 0.7: 1(-5.25,0) 2(5.25,0)
RES-TH_BD2.4-L6.3-P10.30-D0.6
  round 1.3 hole 0.8: 1(-5.15,0) 2(5.15,0)
RES-TH_BD2.5-L6.5-P10.50-D0.6
  round 1.879 hole 1: 1(-5.25,0) 2(5.25,0)
RES-TH_BD2.7-L6.2-P10.20-D0.4
  round 1.4 hole 0.8: 1(-5.1,0) 2(5.1,0)
RES-TH_L5.1-W4.3-P3.40-D0.5
  round 1.524 hole 0.762: 1(0,1.7) 2(0,-1.7)
SMA_L4.3-W2.6-LS5.0-FD
  rect 2.046x1.62 smd: 1(-2.304,-0.009) 2(2.304,0.009)
SW-TH_4P-L6.0-W6.0-P4.50-LS6.5
  round 1.8 hole 1.2: 1(-3.25,2.25) 2(3.25,2.25) 3(-3.25,-2.25) 4(3.25,-2.25)
TF-SMD_TF-PUSH
  rect 0.7x1.6 smd: 1(2.25,5.3) 2(1.15,5.3) 3(0.05,5.3) 4(-1.05,5.3) 5(-2.15,5.3) 6(-3.25,5.3) 7(-4.35,5.3) 8(-5.45,5.3) CD(-6.55,5.3)
  rect 1.2x1.5 smd: 10(-7.75,4.3)
  rect 1.2x2.2 smd: 11(-7.75,-5.3) 12(7.75,-5.3)
  rect 1.6x1.5 smd: 13(6.85,4.3)
USB-C-SMD_HC-TYPE-C-6P-010B
  oval 1x1.7 hole 0.5x1.2: 1(-4.32,1.815) 2(4.32,1.815) 3(-4.32,-1.985) 4(4.32,-1.985)
  rect 0.7x1.5 smd: A5(-0.5,1.985) B5(0.5,1.985)
  rect 0.8x1.5 smd: A9(1.52,1.985) B9(-1.52,1.985)
  rect 0.9x1.5 smd: A12(2.75,1.985) B12(-2.75,1.985)

## Nets
3V3: CARD1.4 R1.1 R2-10k.2 R2-10k#2.2 R3-10k.2 R3-10k#2.2 R4-10k.2 R4-10k#2.2 R5-3k1.2 R5-3k3.2 U1.11 U2.6 U2.15 右传感器
3V3-GND-Signal.1 左传感器
3V3-GND-signal.1
+5V: D1-SS54.2 R14-0.2 U1.15
GND: BUZZER1.2 C1-22uF.2 C2-22uF.2 CARD1.6 CARD1.10 CARD1.11 CARD1.12 CARD1.13 P1.2 R6-1k.2 R6-1k#2.2 R8-5k1.2 R9-5k1.1 R11-10k.1 R12-2k4.1 R13-1k.2 SCREW1.1 SCREW2.1 SCREW3.1 SCREW4.1 U1.10 U1.14 U1-PW6276.5 U1-PW6276.9 U2.7 U2.14 U2-TP4056.1 U2-TP4056.3 U2-TP4056.9 U3.1 U3.2 U3.3 U3.4 U3.A12 U3.B12 右.2 右传感器
3V3-GND-Signal.2 左.2 左传感器
3V3-GND-signal.2 检查线路.1 检查线路.2
BT+: C1-22uF.1 L1-2.2uH.1 P1.1 U1-PW6276.3 U1-PW6276.4 U2-TP4056.5
BUZZER: BUZZER1.1 U2.4
CS: CARD1.2 U2.11
LEFT: U2.2 左.1 左传感器
3V3-GND-signal.3
MISO: CARD1.7 R4-10k.1 R4-10k#2.1 U2.9
MOSI: CARD1.3 R2-10k.1 R2-10k#2.1 U2.10
RIGHT: U2.3 右.1 右传感器
3V3-GND-Signal.3
SCK: CARD1.5 R3-10k.1 R3-10k#2.1 U2.8
SWITCH: R5-3k1.1 R5-3k3.1 U2.1 检查线路.3 检查线路.4
USBIN: R14-0.1 U2-TP4056.4 U2-TP4056.8 U3.A9 U3.B9
$1N4715: L1-2.2uH.2 U1-PW6276.1 U1-PW6276.2
$1N4719: C2-22uF.1 D1-SS54.1 R10-33k.2 U1-PW6276.7 U1-PW6276.8
$1N5109: R10-33k.1 R11-10k.2 U1-PW6276.6
$1N5991: R9-5k1.2 U3.B5
$1N5992: R8-5k1.1 U3.A5
$1N6384: R12-2k4.2 U2-TP4056.2
$1N6472: LED1.1 U2-TP4056.6
$1N6520: LED.1 U2-TP4056.7
$1N6547: LED.2 LED1.2 R13-1k.1
$1N28440: R1.2 R6-1k.1 R6-1k#2.1 U1.1

Pads without a net: CARD1 1 8 CD; U1 2 3 4 5 6 7 8 9 12 13; U2 5 12 13

## Via types
v1: diameter 0.61, hole 0.305, Top Layer to Bottom Layer, 31 vias

## Routing (per net, layer and track width the routed paths; a pad name or vN(x,y) marks a point on that pad's centre or on a via; arc(x,y) is an arc through that point)
3V3: length 203.2
  Top Layer w0.7: 83.2,28.95 81.75,30.4 R4-10k.2 ; 83.2,28.95 v1(83.2,27.45) ; 83.2,28.95 CARD1.4
  Top Layer w0.806: 81.75,45.21 81.75,48.4 v1(81.65,48.5) ; 81.75,45.21 右传感器
3V3-GND-Signal.1 ; 81.75,45.21 R2-10k.2 R3-10k.2 R4-10k.2 ; v1(74.25,52.75) 71.25,49.75 66.75,49.75 64,52.5 R5-3k1.2
  Inner2 w0.806: v1(74.25,52.75) 78.5,48.5 v1(81.65,48.5)
  Bottom Layer w0.7: v1(83.2,27.45) 83.2,26.05 R2-10k#2.2
  Bottom Layer w0.806: U2.6 62.5,33.58 62.5,13.72 U2.15
  Bottom Layer w1.256: U1.11 33,22.38 22.5,32.88 22.5,57.35 R5-3k3.2 16.85,63 15.3,63 R1.1
  Bottom Layer w1.5: U2.15 64.22,12 77.15,12 ; 左传感器
3V3-GND-signal.1 15.35,61.89 15.35,63 ; 77.15,12 R4-10k#2.2 ; 77.15,12 R3-10k#2.2 R2-10k#2.2 ; U1.11 37.16,21.22 62.5,21.22
+5V: length 87.3
  Top Layer w1.5: 38.3,49.51 41.3,49.51 42.8,48.01 v1(47.3,48.01) ; 38.3,49.51 34.76,49.51 R14-0.2 ; 38.3,49.51 38.3,14.52 U1.15 ; D1-SS54.2 v1(72.8,46.51)
  Bottom Layer w1.5: v1(47.3,48.01) 48.8,49.51 65.3,49.51 68.3,46.51 v1(72.8,46.51)
GND: length 336.5
  Top Layer w0.6: 79.59,53.59 78.84,53.59 78.09,52.84 U2-TP4056.1 73.69,56.5 71.5,56.5 ; 79.59,53.59 79.59,54.59 U2-TP4056.9 右传感器
3V3-GND-Signal.2 ; 79.59,53.59 80.63,52.55 U2-TP4056.3
  Top Layer w0.63: U1-PW6276.9 71.5,56.5 71.5,57.28 U1-PW6276.5
  Top Layer w0.7: 87.2,26.75 CARD1.6 ; 87.2,26.75 87.2,33.85 85.7,35.35 CARD1.13 ; 87.2,26.75 87.2,23.75 CARD1.10 79.85,22.25 R13-1k.2
  Top Layer w0.806: R6-1k#2.2 26,35.75 26,34.5 ; C1-22uF.2 26,33 26,34.5 ; 26,34.5 23.85,34.5 20.85,37.5 20.85,39 R6-1k.2
  Top Layer w0.9: U3.2 47.08,63.69 U3.A12 47.25,65.02 48.75,66.52 51.25,66.52 52.75,65.02 U3.B12 54.15,63.52 U3.1
  Top Layer w1: 52.75,65.02 52.75,65.92 U3.3 ; U3.1 58.31,63.69 67,55 U1-PW6276.9 ; 28.75,50.5 28.75,61 31.44,63.69 U3.2 U3.4
  Top Layer w1.077: 83,55 C2-22uF.2
  Top Layer w1.2: 93.25,40.25 89.85,36.85 CARD1.13 ; 93.25,40.25 93.25,43.25 94.75,44.75 94.75,46.25 ; 93.25,40.25 93.25,39.8 CARD1.12 ; 93.2,22.25 93.2,14.53 右.2 ; 93.2,22.25 CARD1.11 ; 93.2,22.25 88.7,22.25 87.2,23.75
  Top Layer w1.256: 64.31,32.54 64.39,32.54 R11-10k.1 ; 64.31,32.54 R12-2k4.1 70.35,26.5 71.1,26.5 ; 64.31,32.54 U2.7 ; R13-1k.2 75.6,26.5 71.1,26.5 ; 71.1,26.5 71.1,21.86 U2.14 ; BUZZER1.2 15.8,40 R6-1k.2
  Top Layer w1.353: R8-5k1.2 29.75,50.5 24.25,50.5 R9-5k1.1 17.25,52.5 13.8,52.5
  Top Layer w1.5: BUZZER1.2 12.3,43.5 12.3,51 13.8,52.5 11.3,55 左传感器
3V3-GND-signal.2 ; 检查线路.2 检查线路.1 91.75,49.25 91.75,53.25 90,55 右传感器
3V3-GND-Signal.2
  Inner2 w1.077: C1-22uF.2 33.5,25.5 35,25.5 35.58,24.92 U1.10
  Inner2 w1.5: 35.58,24.92 34.08,23.42 34.08,16.68 ; 34.08,16.68 28.14,16.68 P1.2 9.46,14 左.2 ; 34.08,16.68 U1.14
BT+: length 138.7
  Top Layer w0.6: U2-TP4056.5 82,57.81 82,57.32 81.5,56.82 v1(80.5,56.82)
  Top Layer w0.63: 22,13.5 25,10.5 37,10.5 62.5,36 v1(62.5,43.5) ; v1(65.5,52.32) 67,50.82 70,50.82 70.63,51.45 U1-PW6276.3 U1-PW6276.4
  Top Layer w1.077: C1-22uF.1 28,27 20,27 L1-2.2uH.1
  Top Layer w1.5: 22,27 22,6.54 P1.1
  Inner2 w0.63: v1(65.5,52.32) 65.5,51.68 62.5,48.68 v1(62.5,43.5)
  Bottom Layer w0.6: v1(80.5,56.82) 71.5,47.82 70,47.82 v1(65.5,52.32)
BUZZER: length 67.3
  Inner2 w1.5: BUZZER1.1 9.2,39 14.5,39 17.5,42 23.5,42 29.5,48 32.5,48 34,49.5 54.66,49.5 U2.4
CS: length 28.4
  Top Layer w0.7: CARD1.2 v1(83.2,31.15)
  Bottom Layer w0.7: v1(83.2,31.15) 80.2,31.15 67.6,18.55 66.26,18.55 65.43,19.38 65.43,20.95 U2.11
LEFT: length 98.7
  Top Layer w1.5: U2.2 55,45.24 49,51.24 34,51.24 31,48.24 19,48.24 17.5,49.74 v1(14.5,49.74)
  Bottom Layer w1.5: 左传感器
3V3-GND-signal.3 13.72,49.74 v1(14.5,49.74) 8.5,43.74 8.5,18.77 左.1
MISO: length 58.4
  Top Layer w0.7: CARD1.7 83.2,25.65 80.2,28.65 80.2,37.95 R4-10k.1
  Top Layer w0.806: 80.2,28.65 76.32,28.65 76.01,28.96 v1(71.51,28.96) v1(67.01,33.46)
  Inner2 w1.5: R4-10k#2.1 71.51,14.66 v1(71.51,28.96)
  Bottom Layer w0.806: U2.9 65.51,28.96 65.51,31.96 v1(67.01,33.46)
MOSI: length 48.5
  Top Layer w0.7: v1(80.25,45) R2-10k.1 ; CARD1.3 85.56,30.05 86.2,30.69 86.2,33.05 83.2,36.05 v1(83.2,37.55)
  Bottom Layer w0.7: R2-10k#2.1 66.85,22.7 81.7,37.55 v1(83.2,37.55) 83.2,42.05 v1(80.25,45)
  Bottom Layer w1.5: U2.10 66.22,22.7 66.85,22.7
RIGHT: length 74.5
  Bottom Layer w1.5: 77.5,48.7 79,47.2 80.5,47.2 94,33.7 94,16.27 右.1 ; 77.5,48.7 86.34,57.54 右传感器
3V3-GND-Signal.3 ; 77.5,48.7 73,44.2 65.5,44.2 U2.3
SCK: length 53.3
  Top Layer w0.7: CARD1.5 v1(86.2,27.85) ; v1(80.25,39.8) R3-10k.1
  Inner2 w0.7: v1(80.25,39.8) 80.25,35.3 86.2,29.35 v1(86.2,27.85)
  Inner2 w0.806: 80.25,35.3 77.25,32.3 66.75,32.3 64.44,30 U2.8
  Inner2 w1.5: R3-10k#2.1 68.94,17.09 68.94,25.5 64.44,30
SWITCH: length 79.9
  Top Layer w0.806: 62.9,55.75 34.4,55.75 R5-3k3.1 ; 62.9,55.75 R5-3k1.1 ; 62.9,55.75 62.9,48.88 U2.1
  Top Layer w1.5: U2.1 67,44.78 67,43.28 70,40.28 v1(73,40.28)
  Inner2 w1.5: 检查线路.4 检查线路.3 74.47,41.75 v1(73,40.28)
USBIN: length 88.2
  Top Layer w0.6: v1(65.02,59.02) 66.52,60.52 71.02,60.52 74.02,57.52 v1(77.02,57.52) 77.7,57.52 U2-TP4056.8 ; v1(60.52,59.02) 57.52,62.02 51.52,62.02 ; v1(81.91,51.13) U2-TP4056.4
  Top Layer w0.8: 48.52,60.52 35.26,60.52 v1(33.52,58.77) ; 48.52,60.52 50.02,60.52 51.52,62.02 U3.B9 ; 48.52,60.52 48.52,63.47 U3.A9
  Inner2 w0.6: v1(77.02,57.52) 77.02,56.02 v1(81.91,51.13)
  Inner2 w0.8: v1(33.52,58.77) 26.02,58.77 18.25,51 18.25,46.5 R14-0.1
  Bottom Layer w0.6: v1(60.52,59.02) v1(65.02,59.02)
$1N4715: length 66.9
  Top Layer w0.63: U1-PW6276.2 U1-PW6276.1 v1(65.09,55.32) ; v1(24.5,33) 23,31.5 L1-2.2uH.2
  Inner2 w0.63: v1(65.09,55.32) 62.09,52.32 v1(30.32,52.32)
  Bottom Layer w0.63: v1(24.5,33) 24.5,46.5 v1(30.32,52.32)
$1N4719: length 42.2
  Top Layer w0.63: D1-SS54.1 70.87,46.16 v1(70.87,48.86) ; v1(67.87,56.36) 67.87,57.68 U1-PW6276.7
  Top Layer w1.256: R10-33k.2 76.66,40.49 75.7,40.49 71.2,44.99 D1-SS54.1
  Bottom Layer w0.63: v1(70.87,48.86) 67.87,51.86 v1(67.87,56.36) 76.5,65 C2-22uF.1
$1N5109: length 35.9
  Top Layer w0.63: U1-PW6276.6 70.63,58.43 69.88,59.18 67.63,59.18 66.85,58.4 v1(66.85,56.9)
  Inner2 w0.63: v1(66.85,56.9) R10-33k.1
  Inner2 w1.256: R11-10k.2 71.85,35 R10-33k.1
$1N5991: length 23.7
  Top Layer w0.7: U3.B5 v1(49.5,62.02)
  Inner2 w0.7: v1(49.5,62.02) 42.49,55 R9-5k1.2
$1N5992: length 38.1
  Top Layer w0.7: U3.A5 50.5,64.37 49.86,65.02 v1(49,65.02)
  Inner2 w0.7: R8-5k1.1 27.27,57.52 41.5,57.52 v1(49,65.02)
$1N6384: length 23
  Top Layer w0.6: R12-2k4.2 79.37,32.22 U2-TP4056.2
$1N6472: length 13.7
  Top Layer w0.6: LED1.1 75.42,60.31 79.73,60.31 80.63,59.41 U2-TP4056.6
$1N6520: length 23.1
  Top Layer w0.6: U2-TP4056.7 79.37,58.45 78.82,59 73.77,59 66.27,66.5 62.23,66.5 LED.1
$1N6547: length 57.5
  Inner2 w1.353: v1(70.77,42.5) 69.27,44 69.27,59 LED.2
  Bottom Layer w1.353: v1(70.77,42.5) 69.27,41 69.27,27.37 R13-1k.1
  Bottom Layer w1.5: LED.2 66.27,68 70.77,68 73.27,65.5 LED1.2
$1N28440: length 56.3
  Top Layer w0.806: R6-1k#2.1 24.25,36.65 35.37,47.78 U1.1
  Inner2 w1.256: R6-1k.1 30.15,41.93 U1.1
  Bottom Layer w1.5: R1.2 17.28,65 24,58.28 30,58.28 36,52.28 U1.1

## Copper pours and planes (outline as drawn; the poured copper is in the pictures)
GND on Inner1: 0,70 100,70 100,0 0,0

## Text on the board
Top Silkscreen Layer: Generic ESP8266 Module | 环境信息收集记录模块 | 天线区
